# Altium schematic sheet Camera.SchDoc
size A
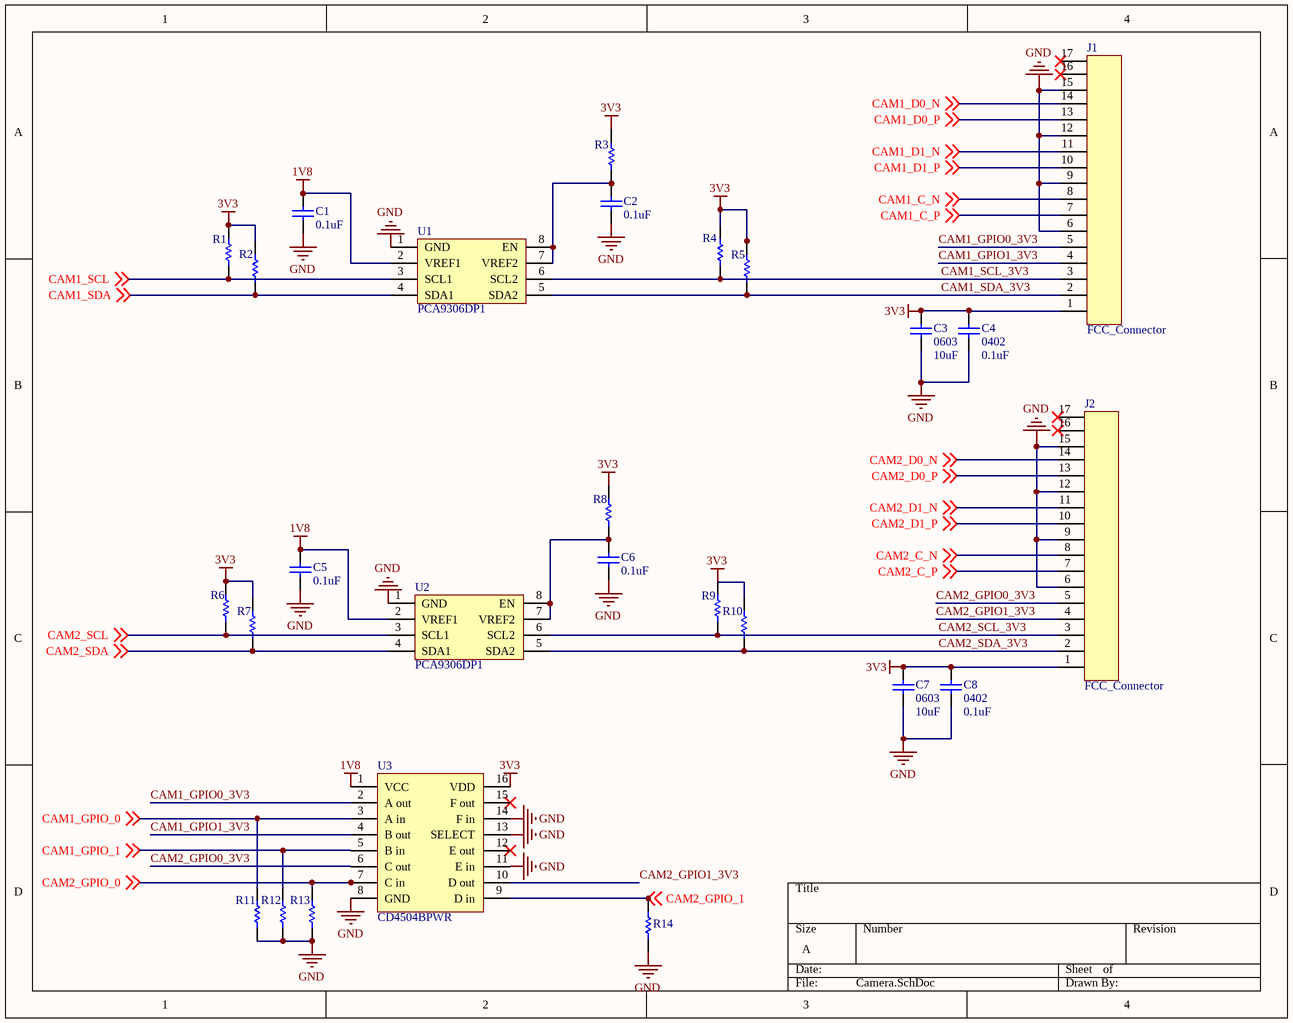
[diagram p0: Camera.SchDoc]

## Parts
C1  value 0.1uF  [0402]  (hidden comment: Cap)
C2  value 0.1uF  [0402]  (hidden comment: Cap)
C3  0603  value 10uF  [1608[0603]]
C4  0402  value 0.1uF  [0402]
C5  value 0.1uF  [0402]  (hidden comment: Cap)
C6  value 0.1uF  [0402]  (hidden comment: Cap)
C7  0603  value 10uF  [1608[0603]]
C8  0402  value 0.1uF  [0402]
J1  FCC_Connector  [CON15_1X15_DRB_S]
J2  FCC_Connector  [CON15_1X15_DRB_S]
R1  Res1  [0402]  (value not drawn)
R2  Res1  [0402]  (value not drawn)
R3  Res1  [0402]  (value not drawn)
R4  Res1  [0402]  (value not drawn)
R5  Res1  [0402]  (value not drawn)
R6  Res1  [0402]  (value not drawn)
R7  Res1  [0402]  (value not drawn)
R8  Res1  [0402]  (value not drawn)
R9  Res1  [0402]  (value not drawn)
R10  Res1  [0402]  (value not drawn)
R11  Res1  [0402]  (value not drawn)
R12  Res1  [0402]  (value not drawn)
R13  Res1  [0402]  (value not drawn)
R14  Res1  [0402]  (value not drawn)
U1  PCA9306DP1  [DCU8]
U2  PCA9306DP1  [DCU8]
U3  CD4504BPWR  [CD4504BPWR_16TSSOP]

## Nets
1V8: C1.2 C5.2 U1.2(VREF1) U2.2(VREF1) U3.1(VCC)
3V3: C3.2 C4.2 C7.2 C8.2 J1.1 J2.1 R1.1 R2.1 R3.1 R4.1 R5.1 R6.1 R7.1 R8.1 R10.1 U3.16(VDD)
GND: C1.1 C2.1 C3.1 C4.1 C5.1 C6.1 C7.1 C8.1 J1.6 J1.9 J1.12 J1.15 J2.6 J2.9 J2.12 J2.15 R11.2 R12.2 R13.2 R14.2 U1.1(GND) U2.1(GND) U3.8(GND) U3.11(E_in) U3.13(SELECT) U3.14(F_in)
CAM1_C_N: J1.8 ; off-sheet CAM1_C_N
CAM1_C_P: J1.7 ; off-sheet CAM1_C_P
CAM1_D0_N: J1.14 ; off-sheet CAM1_D0_N
CAM1_D0_P: J1.13 ; off-sheet CAM1_D0_P
CAM1_D1_N: J1.11 ; off-sheet CAM1_D1_N
CAM1_D1_P: J1.10 ; off-sheet CAM1_D1_P
CAM1_GPIO0_3V3: J1.5 U3.2(A_out)
CAM1_GPIO1_3V3: J1.4 U3.4(B_out)
CAM1_GPIO_0: R11.1 U3.3(A_in) ; off-sheet CAM1_GPIO_0
CAM1_GPIO_1: R12.1 U3.5(B_in) ; off-sheet CAM1_GPIO_1
CAM1_SCL: R1.2 U1.3(SCL1) ; off-sheet CAM1_SCL
CAM1_SCL_3V3: J1.3 R4.2 U1.6(SCL2)
CAM1_SDA: R2.2 U1.4(SDA1) ; off-sheet CAM1_SDA
CAM1_SDA_3V3: J1.2 R5.2 U1.5(SDA2)
CAM2_C_N: J2.8 ; off-sheet CAM2_C_N
CAM2_C_P: J2.7 ; off-sheet CAM2_C_P
CAM2_D0_N: J2.14 ; off-sheet CAM2_D0_N
CAM2_D0_P: J2.13 ; off-sheet CAM2_D0_P
CAM2_D1_N: J2.11 ; off-sheet CAM2_D1_N
CAM2_D1_P: J2.10 ; off-sheet CAM2_D1_P
CAM2_GPIO0_3V3: J2.5 U3.6(C_out)
CAM2_GPIO1_3V3: J2.4 U3.10(D_out)
CAM2_GPIO_0: R13.1 U3.7(C_in) ; off-sheet CAM2_GPIO_0
CAM2_GPIO_1: R14.1 U3.9(D_in) ; off-sheet CAM2_GPIO_1
CAM2_SCL: R6.2 U2.3(SCL1) ; off-sheet CAM2_SCL
CAM2_SCL_3V3: J2.3 R9.2 U2.6(SCL2)
CAM2_SDA: R7.2 U2.4(SDA1) ; off-sheet CAM2_SDA
CAM2_SDA_3V3: J2.2 R10.2 U2.5(SDA2)
NetC2_2: C2.2 R3.2 U1.7(VREF2) U1.8(EN)
NetC6_2: C6.2 R8.2 U2.7(VREF2) U2.8(EN)

Not connected (* = marked no-connect by the designer): J1 16* 17*; J2 16* 17*; R9 1; U3 12(E_out)* 15(F_out)*

## Library data of the parts
C1-C8 = Cap: Capacitor; Published: 8-Jun-2000; LatestRevisionDate: 17-Jul-2002; LatestRevisionNote: Re-released for DXP Platform.; PackageReference: RAD-0.3; Publisher: Altium Limited; PackageDescription: Radial Cap, Thru-Hole; 2 Leads; 0.3 in Pin Spacing
R1-R14 = Res1: Resistor; Published: 8-Jun-2000; LatestRevisionDate: 17-Jul-2002; LatestRevisionNote: Re-released for DXP Platform.; PackageReference: AXIAL-0.3; Publisher: Altium Limited; PackageDescription: Axial Device, Thru-Hole; 2 Leads; 0.3 in Pin Spacing
U1 U2 = PCA9306